# Altium schematic sheet Isolator_SPWM.SchDoc
size A4; SheetNumber: 16; SheetTotal: 16
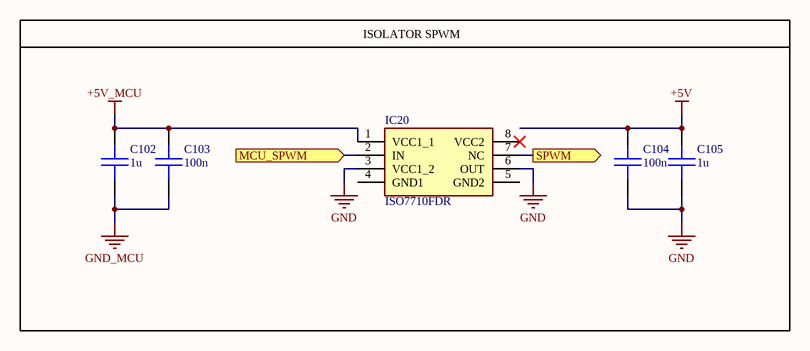
[diagram p0: Isolator_SPWM.SchDoc]

## Parts
C102  1u  [C_0603]
C103  100n  [C_0603]
C104  100n  [C_0603]
C105  1u  [C_0603]
IC20  ISO7710FDR  [SOIC127P600X175-8N]

## Blocks framed on the sheet
ISOLATOR SPWM: C102-C105 IC20

## Ports
MCU_SPWM (in, see Interconnections[5B], Microcontroller[4B]), SPWM (out, see Interconnections[4B], Feedback_Sensors[1A])

## Nets
+5V: C104.2 C105.2
+5V_MCU: C102.2 C103.2 IC20.1(VCC1_1)
GND: C104.1 C105.1 IC20.3(VCC1_2) IC20.6(OUT)
GND_MCU: C102.1 C103.1
MCU_SPWM: IC20.2(IN) ; port MCU_SPWM
SPWM: IC20.7(NC) ; port SPWM

Not connected (* = marked no-connect by the designer): IC20 4(GND1) 5(GND2) 8(VCC2)*

## Library data of the parts
C102-C105 = CAP: SMD Chip Capacitor
IC20 = ISO7710FDR: Integrated Circuit; Manufacturer_Name: Texas Instruments; Datasheet Link: http://www.ti.com/lit/gpn/iso7710; Height: 1.75mm; Manufacturer_Part_Number: ISO7710FDR; Mouser Part Number: 595-ISO7710FDR; Mouser Price/Stock: https://www.mouser.co.uk/ProductDetail/Texas-Instruments/ISO7710FDR?qs=0C8XhJW8e4r482bmRgamQA%3D%3D; Arrow Part Number: ISO7710FDR; Arrow Price/Stock: https://www.arrow.com/en/products/iso7710fdr/texas-instruments?region=nac